# EAGLE design R450B (EAGLE 6.6.0)
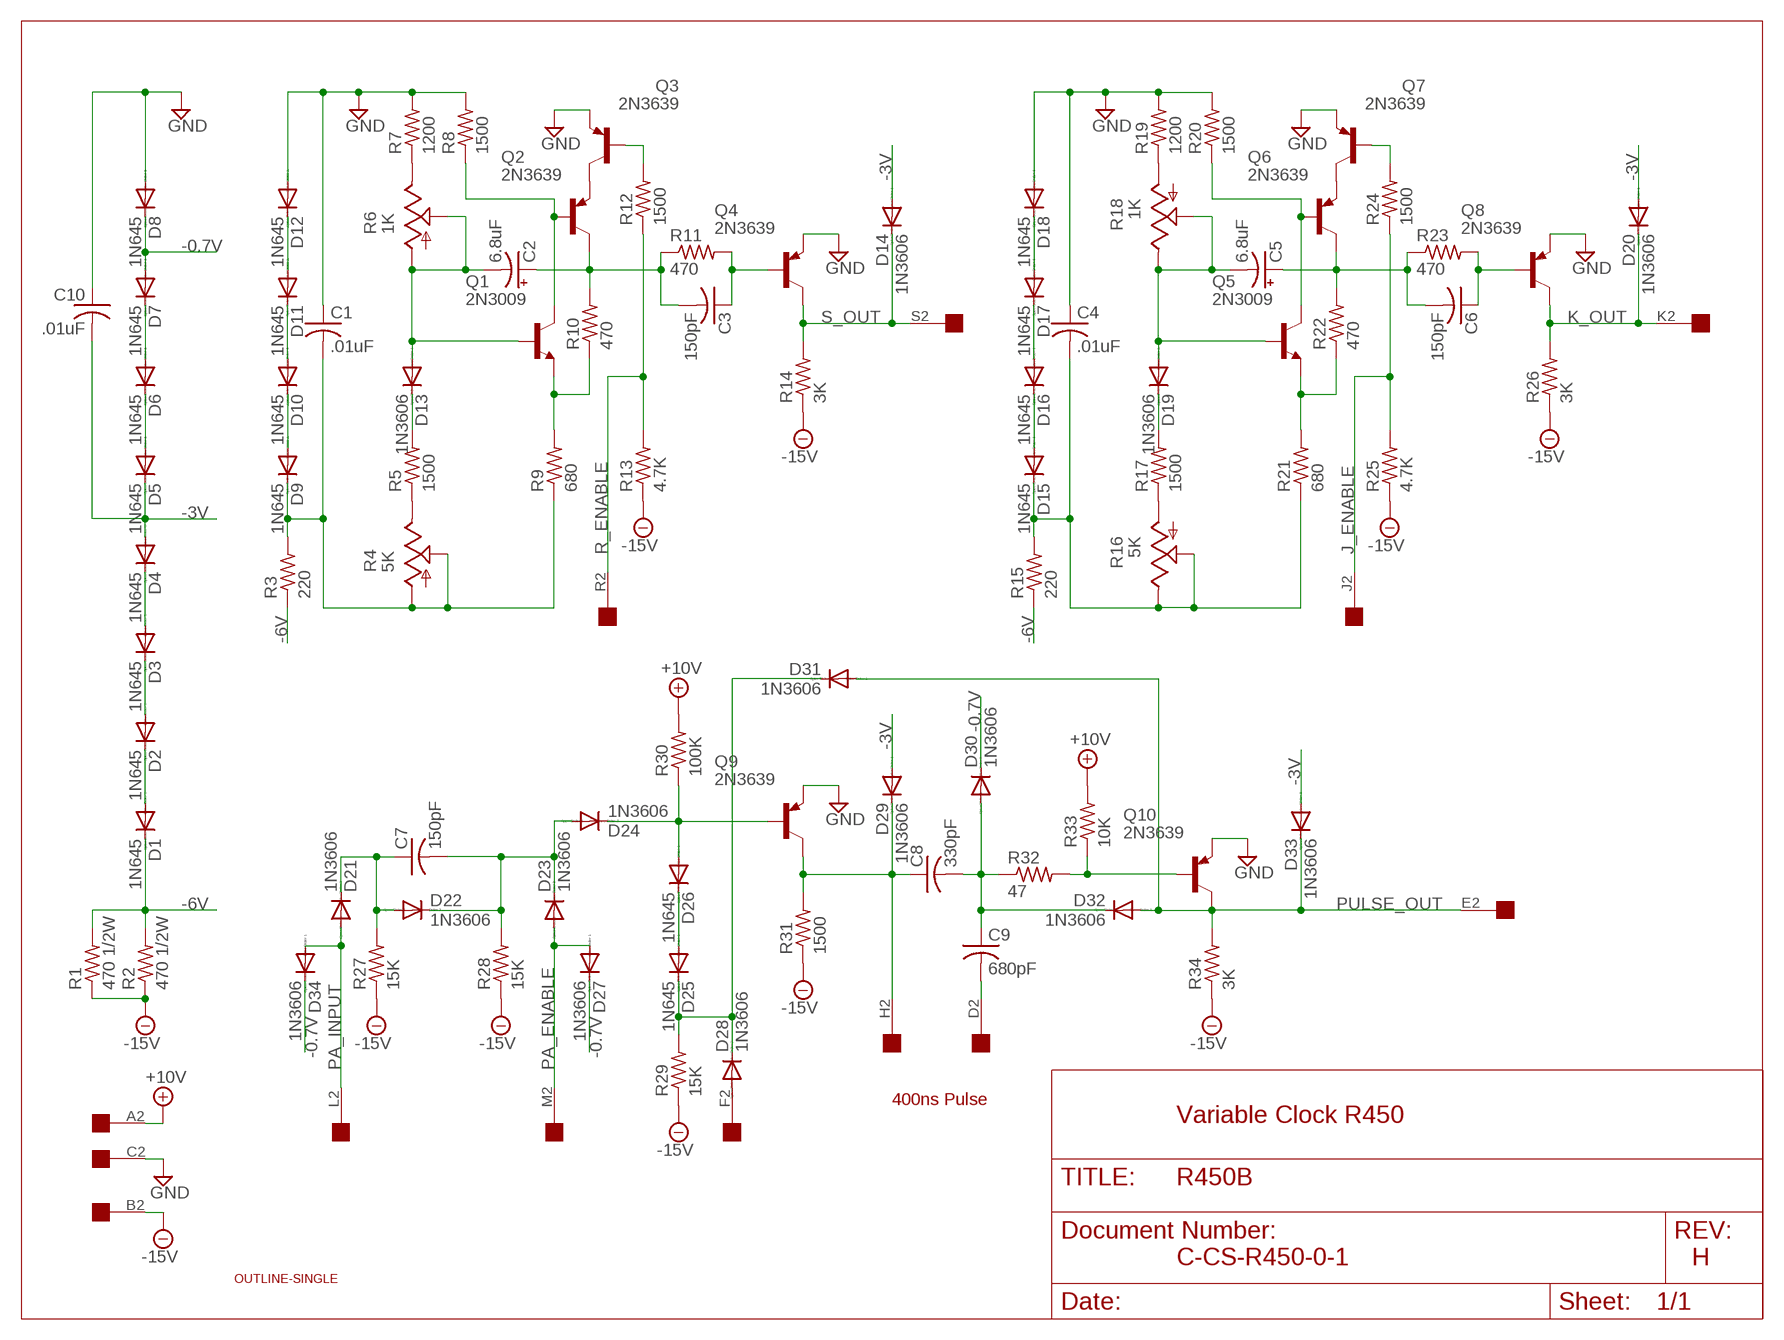
[diagram p0: schematic, sheet 1]

## Parts
C1  .01uF  C-US  [C063-025X075]
C2  6.8uF  CPOL-USE15-5AXIAL  [E15-5]
C3  150pF  C-US075-032X103  [C075-032X103]
C4  .01uF  C-US  [C063-025X075]
C5  6.8uF  CPOL-USE15-5AXIAL  [E15-5]
C6  150pF  C-US  [C063-025X075]
C7  150pF  C-US  [C063-025X075]
C8  330pF  C-US  [C063-025X075]
C9  680pF  C-US  [C063-025X075]
C10  .01uF  C-US  [C063-025X075]
D1  1N645  1N4148DO35-10  [DO35-10]
D2  1N645  1N4148DO35-10  [DO35-10]
D3  1N645  1N4148DO35-10  [DO35-10]
D4  1N645  1N4148DO35-10  [DO35-10]
D5  1N645  1N4148DO35-10  [DO35-10]
D6  1N645  1N4148DO35-10  [DO35-10]
D7  1N645  1N4148DO35-10  [DO35-10]
D8  1N645  1N4148DO35-10  [DO35-10]
D9  1N645  1N4148DO35-10  [DO35-10]
D10  1N645  1N4148DO35-10  [DO35-10]
D11  1N645  1N4148DO35-10  [DO35-10]
D12  1N645  1N4148DO35-10  [DO35-10]
D13  1N3606  1N4148DO35-10  [DO35-10]
D14  1N3606  1N4148DO35-10  [DO35-10]
D15  1N645  1N4148DO35-10  [DO35-10]
D16  1N645  1N4148DO35-10  [DO35-10]
D17  1N645  1N4148DO35-10  [DO35-10]
D18  1N645  1N4148DO35-10  [DO35-10]
D19  1N3606  1N4148DO35-10  [DO35-10]
D20  1N3606  1N4148DO35-10  [DO35-10]
D21  1N3606  1N4148DO35-10  [DO35-10]
D22  1N3606  1N4148DO35-10  [DO35-10]
D23  1N3606  1N4148DO35-10  [DO35-10]
D24  1N3606  1N4148DO35-10  [DO35-10]
D25  1N645  1N4148DO35-10  [DO35-10]
D26  1N645  1N4148DO35-10  [DO35-10]
D27  1N3606  1N4148DO35-10  [DO35-10]
D28  1N3606  1N4148DO35-10  [DO35-10]
D29  1N3606  1N4148DO35-10  [DO35-10]
D30  1N3606  1N4148DO35-10  [DO35-10]
D31  1N3606  1N4148DO35-10  [DO35-10]
D32  1N3606  1N4148DO35-10  [DO35-10]
D33  1N3606  1N4148DO35-10  [DO35-10]
D34  1N3606  1N4148DO35-10  [DO35-10]
Q1  2N3009  2N2102  [TO5]
Q2  2N3639  2N2904  [TO39]
Q3  2N3639  2N2904  [TO39]
Q4  2N3639  2N2904  [TO39]
Q5  2N3009  2N2102  [TO5]
Q6  2N3639  2N2904  [TO39]
Q7  2N3639  2N2904  [TO39]
Q8  2N3639  2N2904  [TO39]
Q9  2N3639  2N2904  [TO39]
Q10  2N3639  2N2904  [TO39]
R1  470 1/2W  R-US_0411/15  [0411/15]
R2  470 1/2W  R-US_0411/15  [0411/15]
R3  220  R-US_0207/10  [0207/10]
R4  5K  TRIM_US-CT6  [CT6]
R5  1500  R-US_0207/10  [0207/10]
R6  1K  TRIM_US-CT6  [CT6]
R7  1200  R-US_0207/10  [0207/10]
R8  1500  R-US_0207/10  [0207/10]
R9  680  R-US_0207/10  [0207/10]
R10  470  R-US_0207/10  [0207/10]
R11  470  R-US_0207/10  [0207/10]
R12  1500  R-US_0207/10  [0207/10]
R13  4.7K  R-US_0207/10  [0207/10]
R14  3K  R-US_0207/10  [0207/10]
R15  220  R-US_0207/10  [0207/10]
R16  5K  TRIM_US-CT6  [CT6]
R17  1500  R-US_0207/10  [0207/10]
R18  1K  TRIM_US-CT6  [CT6]
R19  1200  R-US_0207/10  [0207/10]
R20  1500  R-US_0207/10  [0207/10]
R21  680  R-US_0207/10  [0207/10]
R22  470  R-US_0207/10  [0207/10]
R23  470  R-US_0207/10  [0207/10]
R24  1500  R-US_0207/10  [0207/10]
R25  4.7K  R-US_0207/10  [0207/10]
R26  3K  R-US_0207/10  [0207/10]
R27  15K  R-US_0207/10  [0207/10]
R28  15K  R-US_0207/10  [0207/10]
R29  15K  R-US_0207/10  [0207/10]
R30  100K  R-US_0207/10  [0207/10]
R31  1500  R-US_0207/10  [0207/10]
R32  47  R-US_0207/10  [0207/10]
R33  10K  R-US_0207/10  [0207/10]
R34  3K  R-US_0207/10  [0207/10]
U$1  OUTLINE-SINGLE  [SINGLE]
U$2  EDGE-1  [EDGE-CON1]

## Nets
+10V [Supply]: R30.2 R33.2 U$2.A2
-0.7V [Supply]: D7.A D8.C D27.C D30.C D34.C
-3V [Supply]: C10.2 D4.A D5.C D14.A D20.A D29.A D33.A
-6V [Supply]: D1.C R1.2 R2.2 R3.1 R15.1
-15V [Supply]: R1.1 R2.1 R13.1 R14.1 R25.1 R26.1 R27.1 R28.1 R29.1 R31.1 R34.1 U$2.B2
GND [Supply]: C1.1 C4.1 C10.1 D8.A D12.A D18.A Q3.1(E) Q4.1(E) Q7.1(E) Q8.1(E) Q9.1(E) Q10.1(E) R7.2 R8.2 R19.2 R20.2 U$2.C2
J_ENABLE: R24.1 R25.2 U$2.J2
K_OUT: D20.C Q8.3(C) R26.2 U$2.K2
N$1 [Supply]: D1.A D2.C
N$2 [Supply]: D5.A D6.C
N$3: D11.A D12.C
N$4: D10.A D11.C
N$5: D9.A D10.C
N$6 [Supply]: C1.2 D9.C R3.2 R4.A R4.S R9.1
N$7: Q1.1(E) R9.2 R10.1
N$8: R4.E R5.1
N$9: D13.C R5.2
N$10: C2.- D13.A Q1.2(B) R6.A R6.S
N$11: Q1.3(C) Q2.2(B) R8.1
N$12: C2.+ C3.2 Q2.3(C) R10.2 R11.1
N$13 [Supply]: D2.A D3.C
N$14 [Supply]: D3.A D4.C
N$15: Q3.2(B) R12.2
N$16: Q2.1(E) Q3.3(C)
N$17: R6.E R7.1
N$18: C3.1 Q4.2(B) R11.2
N$19: D17.A D18.C
N$20: D16.A D17.C
N$21: D15.A D16.C
N$22: C4.2 D15.C R15.2 R16.E R16.S R21.1
N$23: D19.C R17.2
N$24: D28.A U$2.F2
N$25: Q5.1(E) R21.2 R22.1
N$26: C7.1 D21.C D22.A R27.2
N$27: R18.A R19.1
N$28: C7.2 D22.C D23.C D24.A R28.2
N$29: Q5.3(C) Q6.2(B) R20.1
N$30: Q6.1(E) Q7.3(C)
N$31: R16.A R17.1
N$32: C5.- D19.A Q5.2(B) R18.E R18.S
N$34: C5.+ C6.2 Q6.3(C) R22.2 R23.1
N$35: C6.1 Q8.2(B) R23.2
N$36: Q7.2(B) R24.2
N$37: C8.1 D29.C Q9.3(C) R31.2 U$2.H2
N$39: D24.C D26.A Q9.2(B) R30.1
N$40: D25.A D26.C
N$41: D25.C D28.C D31.C R29.2
N$43: C8.2 C9.1 D30.A D32.C R32.1
N$44: C9.2 U$2.D2
N$45: Q10.2(B) R32.2 R33.1
N$47 [Supply]: D6.A D7.C
PA_ENABLE: D23.A D27.A U$2.M2
PA_INPUT: D21.A D34.A U$2.L2
PULSE_OUT: D31.A D32.A D33.C Q10.3(C) R34.2 U$2.E2
R_ENABLE: R12.1 R13.2 U$2.R2
S_OUT: D14.C Q4.3(C) R14.2 U$2.S2
Unconnected: U$2.N2 U$2.P2 U$2.T2 U$2.U2 U$2.V2

## Notes on the sheet
- 400ns Pulse
- Variable Clock R450
- C-CS-R450-0-1 | H

## Library data of the parts
C1 C4 C6-C10 = dec-con:C-US: Capacitors with funky DEC lead spacing.
C2 C5 = dec-con:CPOL-USE15-5AXIAL: 0.6" veresion of an electrolytic
C3 = rcl:C-US: CAPACITOR, American symbol
D1-D34 = diode:1N4148: DIODE high speed (Philips)
Q1 Q5 = transistor-npn:2N2102: NPN Transistor
Q2-Q4 Q6-Q10 = transistor-pnp:2N2904*: PNP Transistror
R1-R3 R5 R7-R15 R17 R19-R34 = rcl:R-US_: RESISTOR, American symbol
R4 R6 R16 R18 = pot:TRIM_US-: POTENTIOMETER
U$1 = dec-con:OUTLINE-*: Board outlines for DEC boards.
U$2 = dec-con:EDGE-1: Single-Sided DEC Edge Connector -- (side 2)

## Net classes
1 Supply: width 0.813 mm

## Board
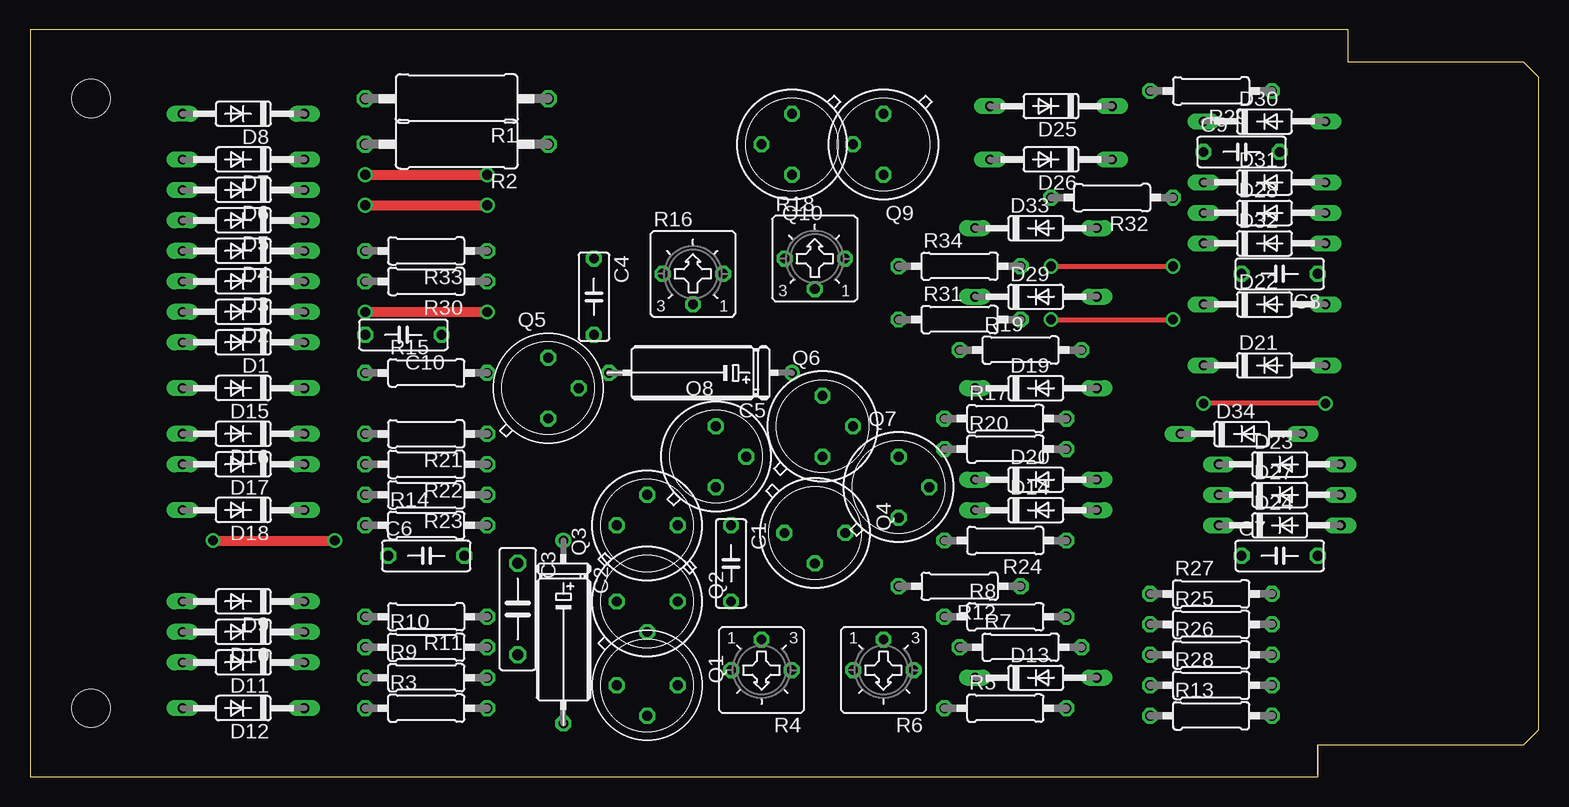
[diagram p1: board, top side]
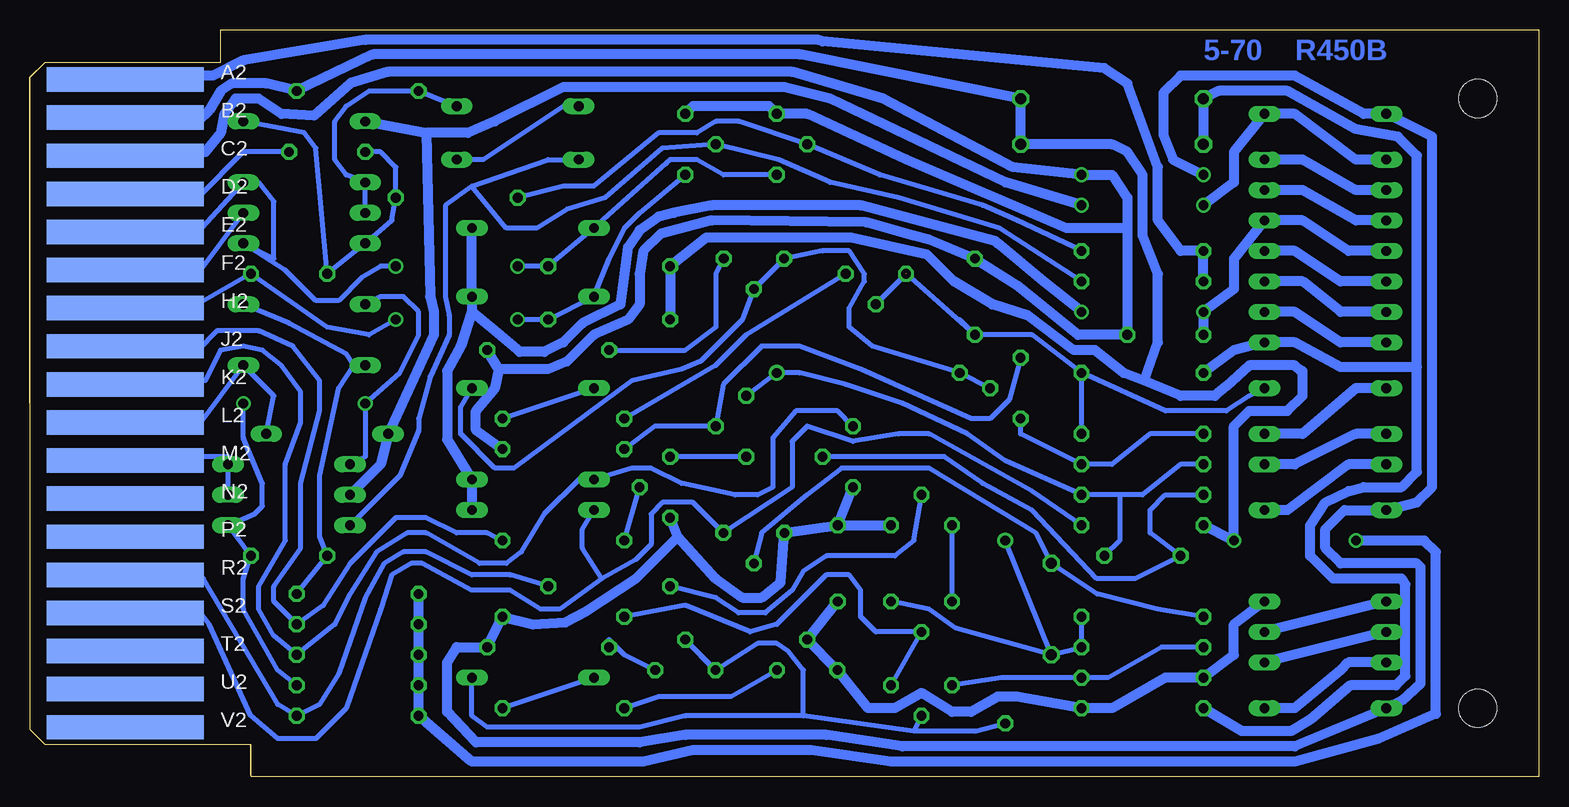
[diagram p2: board, bottom side, seen from below]

Size 125.73 x 62.23 mm. Coordinates in mm from the lower left corner, seen from the top.
Copper layers (1+16): Top 0.035mm / dielectric 1.5mm / Bottom 0.035mm
Design rules "16mils": minimum track width 16mil, minimum drill 32mil, track to track 15mil, track to pad 10mil, pad to pad 10mil, via to via 10mil, smd to smd 10mil, copper to edge 13mil, drill to drill 10mil, minimum pad ring 10mil, minimum via ring 8mil, stop-mask expansion 0mil, vias tented up to drill 0mil, thermal gap 10mil

### Footprints (pad centres in the part's own frame; a part is rotated, then mirrored left to right if it is on the bottom)
C063-025X075 = drill 0.813 octagon: 1 -2.54,0; 2 3.81,0
E15-5 = drill 0.813: + -7.62,0 | drill 0.813 octagon: - 7.62,0
C075-032X103 = drill 0.914 octagon: 1 -3.81,0; 2 3.81,0
DO35-10 = drill 0.813 long: A 5.08,0; C -5.08,0
TO5 = drill 0.813 octagon: 1 0,-2.54; 2 2.54,0; 3 0,2.54
TO39 = drill 0.813 octagon: 1 0,-2.54; 2 2.54,0; 3 0,2.54
0411/15 = drill 0.914 octagon: 1 -7.62,0; 2 7.62,0
0207/10 = drill 0.813 octagon: 1 -5.08,0; 2 5.08,0
CT6 = drill 0.813 octagon: A 2.515,0; E -2.515,0; S 0,-2.54
SINGLE = hole 3.175: 120.65,56.515; 120.65,5.715
EDGE-CON1 = smd 13.106 x 2.032 bottom: A2 7.938,4.128; B2 7.938,7.303; C2 7.938,10.477; D2 7.938,13.652; E2 7.938,16.828; F2 7.938,20.003; H2 7.938,23.177; J2 7.938,26.352; K2 7.938,29.527; L2 7.938,32.703; M2 7.938,35.877; N2 7.938,39.053; P2 7.938,42.227; R2 7.938,45.403; S2 7.938,48.578; T2 7.938,51.752; U2 7.938,54.928; V2 7.938,58.102

### Placement (x,y rotation side)
C1  58.42,18.41 270 top
C2  44.45,12.06 270 top
C3  40.64,13.97 270 top
C4  46.99,40.64 270 top
C5  55.88,33.66 180 top
C6  32.38,18.41 0 top
C7  103.5,18.41 0 top
C8  104.78,41.91 180 top
C9  100.33,52.07 0 top
C10  31.75,36.83 180 top
D1  17.78,36.2 180 top
D2  17.78,38.73 180 top
D3  17.78,41.27 180 top
D4  17.78,43.81 180 top
D5  17.78,46.35 180 top
D6  17.78,48.9 180 top
D7  17.78,51.44 180 top
D8  17.78,55.24 180 top
D9  17.78,14.61 180 top
D10  17.78,12.06 180 top
D11  17.78,9.53 180 top
D12  17.78,5.71 180 top
D13  83.82,8.26 0 top
D14  83.82,22.23 0 top
D15  17.78,32.38 180 top
D16  17.78,28.57 180 top
D17  17.78,26.04 180 top
D18  17.78,22.23 180 top
D19  83.82,32.38 0 top
D20  83.82,24.77 0 top
D21  102.87,34.29 0 top
D22  102.87,39.37 0 top
D23  104.14,26.04 0 top
D24  104.14,20.95 0 top
D25  85.09,55.88 180 top
D26  85.09,51.44 180 top
D27  104.14,23.5 0 top
D28  102.87,46.99 0 top
D29  83.82,40.01 0 top
D30  102.87,54.61 0 top
D31  102.87,49.53 0 top
D32  102.87,44.45 0 top
D33  83.82,45.72 0 top
D34  100.97,28.57 0 top
Q1  51.44,7.62 270 top
Q2  51.44,14.61 270 top
Q3  51.44,20.95 90 top
Q4  65.41,20.32 270 top
Q5  43.18,32.38 0 top
Q6  66.04,29.21 0 top
Q7  72.39,24.13 0 top
Q8  57.15,26.67 0 top
Q9  71.12,52.7 180 top
Q10  63.5,52.7 180 top
R1  35.56,56.52 180 top
R2  35.56,52.7 180 top
R3  33.02,5.71 0 top
R4  60.96,8.89 180 top
R5  81.28,5.71 0 top
R6  71.12,8.89 180 top
R7  82.55,10.79 0 top
R8  81.28,13.34 0 top
R9  33.02,8.26 0 top
R10  33.02,10.79 0 top
R11  33.02,13.34 180 top
R12  77.47,15.88 180 top
R13  98.42,5.08 0 top
R14  33.02,20.95 0 top
R15  33.02,33.66 0 top
R16  55.24,41.91 0 top
R17  81.28,29.84 0 top
R18  65.41,43.18 0 top
R19  82.55,35.56 0 top
R20  81.28,27.3 0 top
R21  33.02,28.57 180 top
R22  33.02,26.04 180 top
R23  33.02,23.5 180 top
R24  81.28,19.68 180 top
R25  98.42,12.7 0 top
R26  98.42,10.16 0 top
R27  98.42,15.24 0 top
R28  98.42,7.62 0 top
R29  98.42,57.15 180 top
R30  33.02,41.27 180 top
R31  77.47,38.1 0 top
R32  90.17,48.26 180 top
R33  33.02,43.81 180 top
R34  77.47,42.55 0 top
U$1  125.73,62.23 180 top
U$2  125.73,62.23 180 top

### Tracks (layer width: path | path; a pad name or v marks a point on that pad's centre or on a via)
+10V
  Bottom 0.813: U$2.A2 117.22,58.04 116.84,58.42 110.49,58.42 107.95,59.69 97.79,61.4 60.01,61.4 59.69,61.28 36.2,59.05 34.29,57.78 31.75,50.8 31.75,46.35 29.84,43.81 R33.2 R30.2
-0.7V  (via drill 0.81)
  Top 0.813: v27.94,47.62 v38.1,47.62
  Bottom 0.813: D7.A 15.24,51.44 20.32,55.24 D8.C 25.4,52.07 25.4,49.53 v27.94,47.62 | v38.1,47.62 44.45,49.53 59.05,56.52 62.87,57.47 81.28,57.47 87,54.61 89.22,53.66 92.71,53.66 | D27.C 96.52,26.04 D34.C 92.08,36.83 92.08,38.73 92.39,40.01 92.71,53.66 | D30.C 92.71,53.66
-3V  (via drill 0.81)
  Top 0.813: v27.94,38.73 v38.1,38.73
  Bottom 0.813: D4.A 15.88,43.81 19.68,46.35 D5.C 25.4,43.18 25.4,40.64 v27.94,38.73 C10.2 | D14.A D20.A 90.96,28.1 90.96,33.81 89.85,35.88 88.9,38.73 | v38.1,38.73 41.27,41.27 45.09,44.45 45.24,44.61 56.52,47.62 68.9,47.62 72.07,46.99 73.34,46.67 74.93,45.56 75.88,44.13 76.52,39.37 79.69,37.78 81.28,36.2 82.87,35.4 84.93,35.4 87,37.15 88.9,38.73 | 88.9,40.64 D29.A | D29.A D33.A | D29.A 88.9,38.73
-6V
  Bottom 0.813: R2.2 R1.2 26.67,57.15 20.95,57.15 15.24,53.98 11.75,53.34 10.16,51.75 10.16,34.13 | 10.16,34.13 16.51,34.13 20.32,36.2 D1.C 25.4,35.56 R15.1 | R3.1 24.77,3.81 20.64,3.81 19.05,4.76 15.72,7.62 11.91,7.62 11.11,8.41 11.11,16.03 11.43,16.51 17.14,16.51 19.05,18.41 19.05,20.95 17.78,22.86 15.88,23.81 14.61,24.13 11.43,24.13 10.16,25.4 10.16,34.13
-15V  (via drill 0.81)
  Top 0.813: v15.24,19.68 v25.4,19.68
  Bottom 0.813: U$2.B2 117.13,54.9 116.84,54.61 111.76,54.61 110.81,55.56 109.86,57.15 108.9,57.78 106.05,57.78 R29.1 97.16,60.2 61.59,60.2 R1.1 R2.1 35.56,52.7 34.29,52.07 33.02,50.16 33.02,45.09 31.75,41.91 31.75,36.2 32.86,33.02 | R27.1 R25.1 R26.1 R28.1 R13.1 88.9,1.27 74.61,1.27 70.48,2.22 60.64,2.22 53.98,1.27 20.32,1.27 13.34,3.17 8.57,5.24 8.57,18.73 9.53,19.68 v15.24,19.68 | R14.1 v25.4,19.68 25.4,29.21 24.13,30.48 20.95,30.48 19.68,31.75 19.68,33.81 19.84,33.81 20.32,34.29 24.13,34.29 26.04,32.54 26.99,31.75 29.84,31.75 32.86,33.02 | R31.1 R34.1 69.37,44.93 57.31,44.93 50.96,43.5 48.74,41.27 45.56,39.37 42.55,38.42 38.73,35.56 36.99,35.56 34.61,33.66 32.86,33.02
GND  (via drill 0.81)
  Top 0.813: v27.94,50.16 v38.1,50.16
  Bottom 0.813: v27.94,50.16 30.48,51.44 31.27,53.5 31.27,56.99 29.84,58.42 20.32,58.42 14.61,55.24 D8.A 8.89,53.34 8.89,24.13 10.16,22.86 D18.A 16.19,22.23 17.78,20.64 17.78,19.05 16.51,17.78 10.16,17.78 9.84,17.46 9.84,7.78 11.43,6.35 D12.A 20.32,2.54 53.02,2.54 59.37,3.49 71.12,3.49 74.93,2.86 88.58,2.86 90.96,5.4 90.96,9.53 90.17,10.79 R7.2 R8.2 83.82,12.7 81.12,12.86 79.38,13.81 75.25,16.51 71.75,20 | 34.29,45.72 34.29,48.26 35.56,50.16 v38.1,50.16 43.81,50.8 54.61,56.52 62.23,58.74 95.89,58.74 99.06,57.78 102.08,55.09 104.78,55.24 106.68,56.52 108.58,56.52 109.54,55.24 109.86,53.66 111.12,52.07 116.84,52.07 U$2.C2 | 34.29,45.72 C10.1 38.42,36.83 43.5,40.96 C4.1 50.8,44.77 52.07,45.09 56.04,46.2 68.9,46.35 73.18,45.24 74.61,43.81 74.93,41.91 74.93,39.37 75.88,38.1 78.74,36.83 80.96,34.61 82.55,33.97 86.68,33.97 | C1.1 Q3.1 | 71.75,20 68.58,16.51 66.36,14.92 64.77,14.92 63.18,16.19 Q4.1 C1.1 | 71.75,20 Q7.1 | C1.1 Q8.1 | Q9.1 70.48,55.88 64.14,55.88 Q10.1 60.96,55.24 52.7,51.44 39.37,45.72 34.29,45.72 | 86.68,33.97 87,32.38 88.58,30.48 88.58,28.89 R20.2 | 86.68,33.97 R19.2
J_ENABLE
  Bottom 0.406: U$2.J2 117.17,35.89 116.84,35.56 111.76,35.56 110.17,37.15 106.68,37.15 103.82,35.88 101.6,33.02 101.6,30.48 103.19,24.45 103.19,19.05 105.41,15.88 105.41,14.61 R25.2 101.28,14.29 99.06,17.78 95.25,21.59 92.71,21.59 90.17,20.32 87.63,20.32 R24.1
K_OUT
  Bottom 0.406: U$2.K2 117.14,32.72 116.84,33.02 111.12,33.02 109.86,35.56 107.95,35.88 106.36,35.56 104.78,34.29 103.19,32.07 103.19,29.53 104.46,26.04 104.46,19.68 106.68,15.88 106.68,13.97 105.41,11.75 R26.2 100.33,12.7 99.06,15.24 96.84,18.73 94.3,20.32 92.71,20.32 88.27,17.78 86.04,17.78 84.77,18.73 82.87,21.91 80.01,24.77 D20.C 75.56,25.72 73.98,25.72 71.44,24.45 66.99,23.5 65.09,23.5 63.82,24.13 63.82,28.26 61.91,30.48 58.42,30.48 Q8.3
N$1
  Bottom 0.813: D1.A 16.51,36.2 20.32,38.73 D2.C
N$2
  Bottom 0.813: D5.A 15.24,46.35 19.68,48.9 D6.C
N$3
  Bottom 0.813: D11.A 15.88,9.53 16.51,8.89 20.32,5.71 D12.C
N$4
  Bottom 0.813: D10.A D11.C
N$5
  Bottom 0.813: D9.A D10.C
N$6
  Bottom 0.813: D9.C 25.4,12.7 25.4,10.16 R9.1 31.11,8.26 35.56,5.71 R3.2 43.5,6.67 45.09,6.67 47.31,5.4 48.9,5.4 51.44,6.99 53.66,5.71 55.88,5.71 58.42,8.89 R4.A 60.98,11.46 R4.S C1.2
N$7
  Bottom 0.406: R10.1 31.43,10.79 35.88,8.26 R9.2 44.77,8.26 Q1.1
N$8
  Bottom 0.406: R4.E 67.31,6.67 73.34,6.67 R5.1
N$9
  Bottom 0.406: D13.C R5.2
N$10
  Bottom 0.406: D13.A 88.9,5.08 87.63,4.13 74.93,4.13 71.12,5.08 61.28,5.08 | C2.- 46.99,3.81 52.07,3.81 | 52.07,3.81 Q1.2 | 52.07,3.81 61.28,5.08 | 61.28,5.08 61.28,8.89 62.55,10.48 63.5,11.11 65.09,11.11 68.58,8.89 R6.S R6.A
N$11
  Bottom 0.406: R8.1 71.12,14.29 65.72,12.06 63.5,12.7 59.37,16.83 57.47,16.83 56.52,15.56 56.52,13.34 55.24,12.06 Q2.2 Q1.3
N$12
  Bottom 0.406: Q2.3 50.8,13.97 48.58,12.38 C3.2 | R11.1 R10.2 C3.2 | C3.2 C2.+
N$13
  Bottom 0.813: D2.A 16.51,38.73 19.68,41.27 D3.C
N$14
  Bottom 0.813: D3.A 16.51,41.27 20.32,43.81 D4.C
N$15
  Bottom 0.406: R12.2 68.58,14.92 66.67,13.65 64.45,13.65 62.23,15.56 61.28,17.14 59.37,18.41 53.66,18.41 52.07,19.68 Q3.2
N$16
  Bottom 0.406: Q2.1 Q3.3
N$17
  Bottom 0.406: R6.E 76.2,10.16 77.47,11.43 R7.1
N$18
  Bottom 0.406: R11.2 31.75,13.97 36.83,15.24 C3.1 41.91,20.32 50.8,25.72 58.1,25.72 60.96,23.5 64.77,20.32 Q4.2
N$19
  Bottom 0.813: D17.A 15.88,26.04 20.95,22.23 D18.C
N$20
  Bottom 0.813: D16.A 15.24,28.57 20.32,26.04 D17.C
N$21
  Bottom 0.813: D15.A 15.24,32.38 19.68,28.57 D16.C
N$22  (1 unrouted)
  Bottom 0.406: D15.C 24.13,31.75 26.04,30.48 31.11,30.48 R15.2 | R21.1 R15.2 | R15.2 42.23,36.83 C4.2 | 48.26,38.1 C4.2 | C4.2 52.7,41.91 R16.S
N$23
  Bottom 0.406: D19.C R17.2
N$24
  Bottom 0.406: U$2.F2 117.81,41.91 111.76,41.91 D28.A
N$25
  Bottom 0.406: R21.2 32.38,28.57 35.56,26.04 R22.1 43.18,28.57 Q5.1
N$26
  Bottom 0.406: 98.74,34.29 D21.C | R27.2 C7.1 101.6,20 101.6,25.08 100.01,32.38 98.74,34.29 | D22.A 104.14,37.78 99.38,35.24 98.74,34.29
N$27
  Bottom 0.406: R19.1 71.12,35.56 68.58,37.47 68.58,41.91 R18.A
N$28  (via drill 0.81)
  Top 0.406: v107.95,31.11 v97.79,31.11
  Bottom 0.406: D23.C 97.79,26.67 v97.79,31.11 94.93,33.66 93.34,36.83 93.34,38.73 94.61,40.01 96.52,40.01 D22.C | v107.95,31.11 107.95,28.26 106.36,24.45 106.36,22.54 107,21.91 D24.A C7.2 107.95,16.51 107.95,13.97 105.09,8.89 R28.2
N$29
  Bottom 0.406: Q5.3 44.13,31.43 45.72,29.84 47.31,29.84 56.52,33.97 61.59,35.88 64.77,35.88 67.94,32.7 Q6.2 73.66,29.21 R20.1
N$30
  Bottom 0.406: Q6.1 Q7.3
N$31
  Bottom 0.406: R16.A 66.04,36.83 68.58,34.29 R17.1
N$32
  Bottom 0.406: Q5.2 C5.- 55.56,35.88 57.47,37.47 57.47,39.05 56.2,41.27 56.2,41.91 57.47,43.81 59.69,43.81 62.87,43.18 R18.S 66.36,38.1 69.85,34.61 71.44,33.97 75.56,33.02 85.41,25.72 87,25.72 89.85,28.57 89.85,30.8 D19.A
  Bottom 0.813: R18.E 62.87,43.18
N$34
  Bottom 0.406: Q6.3 C5.+ 61.59,33.66 57.78,32.7 53.02,31.11 47.62,28.57 44.45,26.35 R23.1 34.92,23.5 | C6.2 34.92,19.68 34.92,23.5 | R22.2 29.84,26.04 33.02,23.5 34.92,23.5
N$35
  Bottom 0.406: R23.2 31.11,23.5 32.38,22.23 32.38,20.32 C6.1 33.66,16.51 36.83,16.51 42.23,22.23 46.35,24.45 49.53,26.67 Q8.2
N$36
  Bottom 0.406: R24.2 Q7.2
N$37  (via drill 0.81)
  Top 0.406: v85.09,38.1 v95.25,38.1
  Bottom 0.406: U$2.H2 117.76,39.37 111.76,39.37 C8.1 100.97,37.47 97.47,36.83 v95.25,38.1 | Q9.3 74.93,46.99 76.2,45.72 77.47,43.18 D29.C R31.2 v85.09,38.1
N$39
  Bottom 0.406: D24.C 94.93,25.08 93.34,28.89 93.34,29.84 92.39,33.34 90.81,36.83 90.81,38.42 91.12,40.01 91.12,47.62 88.9,49.21 | 88.9,49.21 82.55,51.44 D26.A | R30.1 44.93,45.72 53.34,48.26 59.05,49.53 63.34,51.44 Q9.2 73.03,52.39 77.79,48.26 80.96,47.31 83.5,45.72 86.04,45.72 88.9,49.21
N$40
  Bottom 0.406: D25.A 81.28,55.88 87.95,51.44 D26.C
N$41
  Bottom 0.406: D28.C D31.C 99.38,50.16 100.33,51.44 100.33,54.61 99.38,55.88 97.47,57.15 R29.2 D25.C
N$43
  Bottom 0.406: D30.A 102.87,53.66 101.92,52.39 C8.2 D32.C 95.57,46.35 R32.1 95.25,50.8 96.52,52.07 C9.1
N$44
  Bottom 0.406: U$2.D2 117.73,48.26 111.76,48.26 107.95,52.07 C9.2
N$45
  Bottom 0.406: R33.1 43.5,46.35 46.35,47.62 54.93,50.16 Q10.2 66.67,54.61 68.58,54.61 70.17,53.66 73.34,53.66 78.74,49.21 81.28,49.21 R32.2
N$47
  Bottom 0.813: D6.A 15.24,48.9 19.68,51.44 D7.C
PA_ENABLE
  Bottom 0.406: U$2.M2 116.84,26.67 109.22,26.67 D23.A D27.A
PA_INPUT
  Bottom 0.406: U$2.L2 117.17,29.54 116.84,29.21 111.76,29.21 D21.A 105.41,31.75 D34.A
PULSE_OUT  (via drill 0.81)
  Top 0.406: v85.09,42.55 v95.25,42.55
  Bottom 0.406: U$2.E2 117.71,45.72 111.44,45.72 D31.A 106.68,49.53 105.41,47.94 105.41,43.18 D32.A 104.46,42.23 101.92,39.69 100.01,39.69 98.11,41.59 96.52,42.55 v95.25,42.55 | Q10.3 67.94,50.16 70.17,51.44 72.39,51.44 72.71,51.12 D33.C R34.2 v85.09,42.55
R_ENABLE
  Bottom 0.406: U$2.R2 115.9,16.84 115.57,16.51 111.28,16.51 105.09,6.03 R13.2 101.6,6.03 100.01,8.57 97.79,14.92 96.2,17.78 94.61,18.73 92.71,18.73 88.9,16.83 85.72,16.83 R12.1
S_OUT
  Bottom 0.406: U$2.S2 117.73,13.97 111.76,13.97 110.81,12.7 107.31,5.08 105.09,3.17 101.92,3.17 99.38,5.71 96.52,13.97 95.57,16.83 93.98,17.78 93.03,17.78 88.9,15.56 85.72,15.56 83.19,13.97 81.6,13.97 78.11,16.51 | 78.11,16.51 79.69,19.05 79.69,20.64 D14.C | 78.11,16.51 75.25,18.1 73.98,19.37 73.98,21.91 73.03,22.86 70.48,22.86 Q4.3 62.23,24.13 62.23,27.94 60.96,29.21 57.15,27.94 53.34,28.57 50.8,28.57 42.23,23.81 R14.2

### Text on the board
Bottom: R450B | 5-70
200bmp: C:/Users/Vince/Documents/eagle/projects/DEC/Rxxx/R450/R450Bbackfb.bmp